# Altium schematic sheet LP_ECG_Pheripherals-X01.SchDoc: PHERIPHERALS
size Letter; Author: C. DEMOLDER; CompanyName: GTBID; DrawnBy: C. DEMOLDER; Engineer: C. DEMOLDER; Organization: GEORGIA TECH; Address1: NORTH AVE NW; Address2: ATLANTA, GA, 30332; DocumentNumber: P001; Revision: X01; SheetNumber: 2; SheetTotal: 4
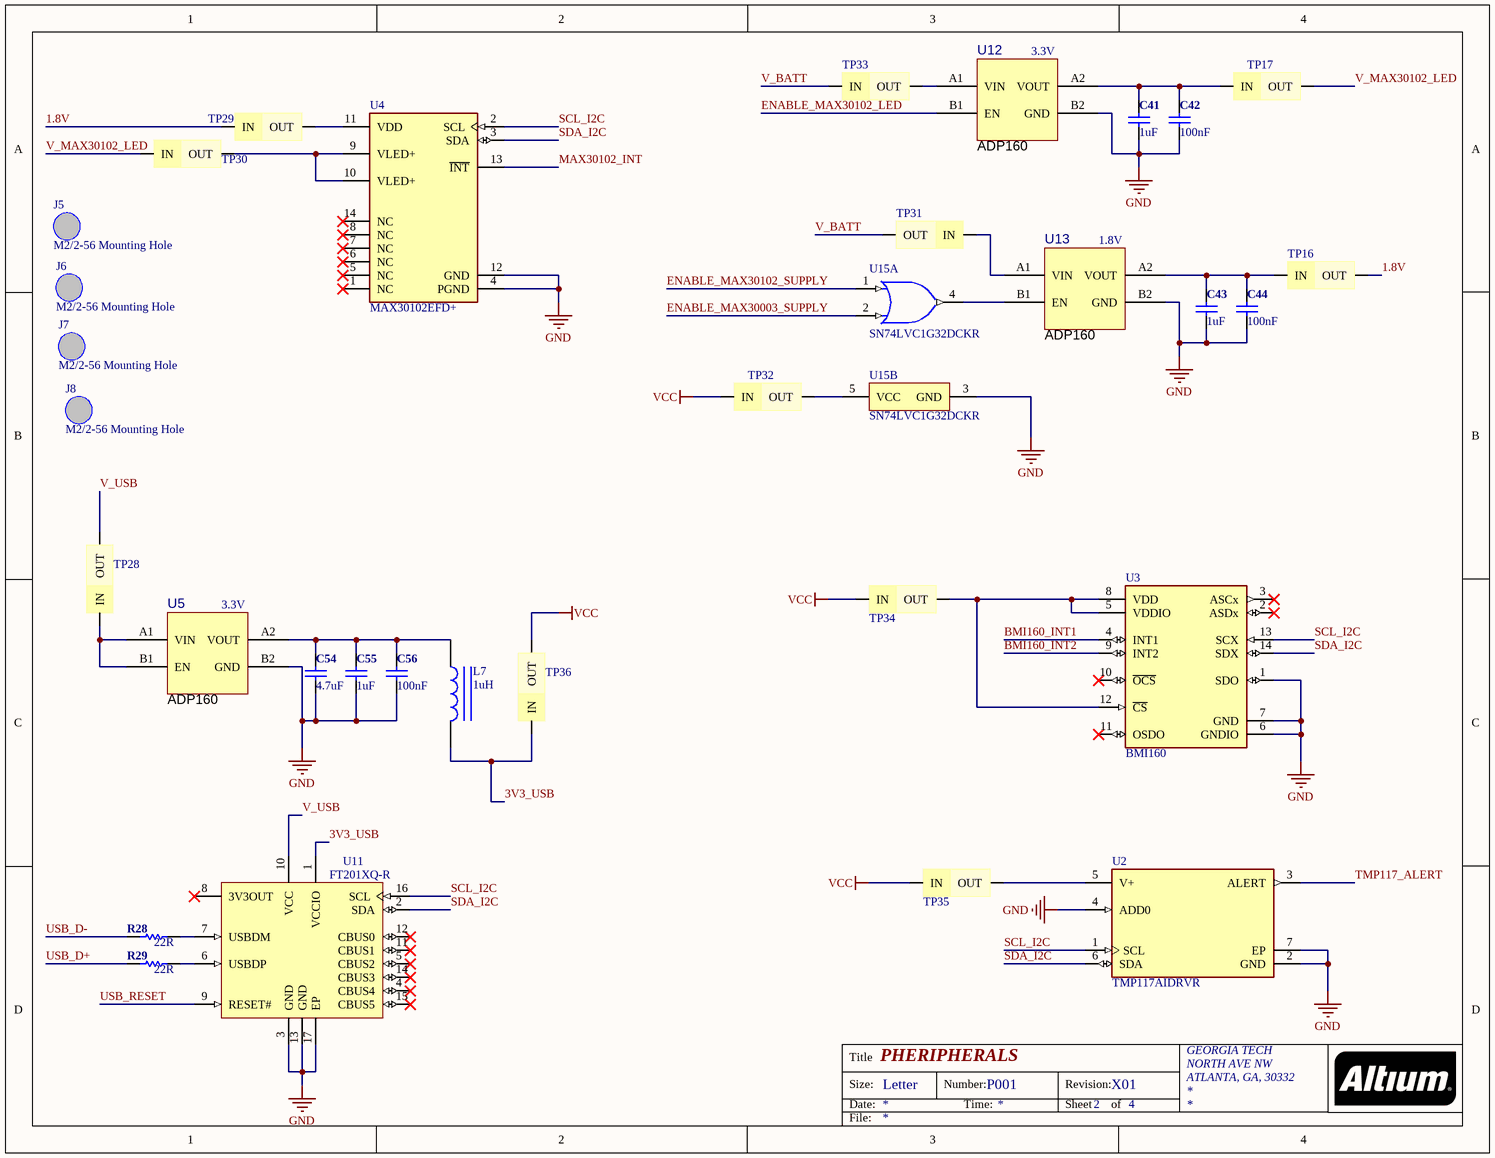
[diagram p0: LP_ECG_Pheripherals-X01.SchDoc]

## Parts
C41  1uF  [C0402]
C42  100nF  [C0402]
C43  1uF  [C0402]
C44  100nF  [C0402]
C54  4.7uF  [C0402]
C55  1uF  [C0402]
C56  100nF  [C0402]
J5  M2/2-56 Mounting Hole  [Mounting Hole]
J6  M2/2-56 Mounting Hole  [Mounting Hole]
J7  M2/2-56 Mounting Hole  [Mounting Hole]
J8  M2/2-56 Mounting Hole  [Mounting Hole]
L7  1uH  [L0402]
R28  22R  [R0402]
R29  22R  [R0402]
TP16  JUMPER  [JUMPER]  (value not drawn)
TP17  JUMPER  [JUMPER]  (value not drawn)
TP28  JUMPER  [JUMPER]  (value not drawn)
TP29  JUMPER  [JUMPER]  (value not drawn)
TP30  JUMPER  [JUMPER]  (value not drawn)
TP31  JUMPER  [JUMPER]  (value not drawn)
TP32  JUMPER  [JUMPER]  (value not drawn)
TP33  JUMPER  [JUMPER]  (value not drawn)
TP34  JUMPER  [JUMPER]  (value not drawn)
TP35  JUMPER  [JUMPER]  (value not drawn)
TP36  JUMPER  [JUMPER]  (value not drawn)
U2  TMP117AIDRVR  [TMP117AIDRVR]
U3  BMI160  [FP-BMI160-MFG]
U4  MAX30102EFD+  [FP-F143A5-1-MFG]
U5  ADP160  Output Voltage: 3.3V  [ADP160]
U11  FT201XQ-R  [QFN-16_N]
U12  ADP160  Output Voltage: 3.3V  [ADP160]
U13  ADP160  Output Voltage: 1.8V  [ADP160]
U15  SN74LVC1G32DCKR  [DCK0005A_N]  (parts A,B of 2)

## Nets
GND: C41.2 C42.1 C43.2 C44.1 C54.2 C55.2 C56.1 U2.2(GND) U2.4(ADD0) U2.7(EP) U3.1(SDO) U3.6(GNDIO) U3.7(GND) U4.4(PGND) U4.12(GND) U5.B2(GND) U11.3(GND) U11.13(GND) U11.17(EP) U12.B2(GND) U13.B2(GND) U15.3(GND)
VCC: TP32.1(IN) TP34.1(IN) TP35.1(IN) TP36.2(OUT)
1.8V: TP16.2(OUT) TP29.1(IN)
3V3_USB: L7.2 TP36.1(IN) U11.1(VCCIO)
BMI160_INT1: U3.4(INT1)
BMI160_INT2: U3.9(INT2)
ENABLE_MAX30003_SUPPLY: U15.2(B)
ENABLE_MAX30102_LED: U12.B1(EN)
ENABLE_MAX30102_SUPPLY: U15.1(A)
MAX30102_INT: U4.13(~{INT})
SCL_I2C: U2.1(SCL) U3.13(SCX) U4.2(SCL) U11.16(SCL)
SDA_I2C: U2.6(SDA) U3.14(SDX) U4.3(SDA) U11.2(SDA)
TMP117_ALERT: U2.3(ALERT)
USB_D+: R29.1
USB_D-: R28.1
USB_RESET: U11.9(RESET#)
V_BATT: TP31.2(OUT) TP33.1(IN)
V_MAX30102_LED: TP17.2(OUT) TP30.1(IN)
V_USB: TP28.2(OUT) U11.10(VCC)
NetC41_1: C41.1 C42.2 TP17.1(IN) U12.A2(VOUT)
NetC43_1: C43.1 C44.2 TP16.1(IN) U13.A2(VOUT)
NetC54_1: C54.1 C55.1 C56.2 L7.1 U5.A2(VOUT)
NetR28_2: R28.2 U11.7(USBDM)
NetR29_2: R29.2 U11.6(USBDP)
NetTP28_1: TP28.1(IN) U5.A1(VIN) U5.B1(EN)
NetTP29_2: TP29.2(OUT) U4.11(VDD)
NetTP30_2: TP30.2(OUT) U4.9(VLED+) U4.10(VLED+)
NetTP31_1: TP31.1(IN) U13.A1(VIN)
NetTP32_2: TP32.2(OUT) U15.5(VCC)
NetTP33_2: TP33.2(OUT) U12.A1(VIN)
NetTP34_2: TP34.2(OUT) U3.5(VDDIO) U3.8(VDD) U3.12(~{CS})
NetTP35_2: TP35.2(OUT) U2.5(V+)
NetU13_B1: U13.B1(EN) U15.4(Y)

Not connected (* = marked no-connect by the designer): U3 2(ASDx)* 3(ASCx)* 10(~{OCS})* 11(OSDO)*; U4 1(NC)* 5(NC)* 6(NC)* 7(NC)* 8(NC)* 14(NC)*; U11 4(CBUS4)* 5(CBUS2)* 8(3V3OUT)* 11(CBUS1)* 12(CBUS0)* 14(CBUS3)* 15(CBUS5)*

## Notes on the sheet
- Title
- Size:
- Date:
- Letter
- Number:
- Time:
- Revision:
- Sheet
- of
- File:

## Library data of the parts
C41 C43 C55 = C-0402(1005): Ceramic Capacitor, Multilayer, Ceramic, 6.3V, 20% +Tol, 20% -Tol, X5R, 15% TC, 1uF, Surface Mount, 0402; Manufacturer: Yageo; Manufacturer Part Number: CC0402MRX5R5BB105; Dissipation Factor: 10%; ComponentLink1URL: https://datasheet.ciiva.com/169/product-169683.pdf; ComponentLink1Description: https://datasheet.ciiva.com/169/product-169683.pdf; Supplier 1: Digi-Key; Supplier Part Number 1: 311-1441-1-ND; RoHS: Yes; Category: Ceramic Capacitors; Stock 1: 16697; Pricing 1: 1=0.13000, 10=0.08900, 100=0.04200, 500=0.02946, 1000=0.02439, 2500=0.02270, 5000=0.02076 (USD); Mount: Surface Mount; Case/Package: 0402; Number of Pins: 2; Case Code (Imperial): 0402; Case Code (Metric): 1005; Min Operating Temperature: -55°C; Max Operating Temperature: 85°C; Capacitance: 1uF; Tolerance: 20%; Voltage Rating: 6.3V; Voltage Rating (DC): 6.3V; Packaging: Tape and Reel; Package Quantity: 1; Dielectric: X5R; Termination: SMD/SMT; Composition: Ceramic; Length: 1mm; Height: 0.5mm; Width: 0.5mm; Thickness: 0.022inch; Depth: 0.5mm; Lead Free: Lead Free; Halogen Free: Halogen Free; ComponentLink2URL: https://datasheet.ciiva.com:443/pdfs/VipMasterIC/IC/YAGO/YAGO-S-A0006851646/YAGO-S-A0006851646-1.pdf?src-supplier=IHS+Markit; ComponentLink2Description: https://datasheet.ciiva.com:443/pdfs/VipMasterIC/IC/YAGO/YAGO-S-A0006851646/YAGO-S-A0006851646-1.pdf?src-supplier=IHS+Markit; ComponentLink3URL: https://datasheet.ciiva.com/176/mlccorderingcode-176806.pdf?src-supplier=Digi-Key; ComponentLink3Description: https://datasheet.ciiva.com/176/mlccorderingcode-176806.pdf?src-supplier=Digi-Key; ComponentLink4URL: https://datasheet.ciiva.com/176/mlccorderingcode-176807.pdf?src-supplier=Digi-Key; ComponentLink4Description: https://datasheet.ciiva.com/176/mlccorderingcode-176807.pdf?src-supplier=Digi-Key; ComponentLink5URL: https://datasheet.ciiva.com/176/mlccorderingcode-176808.pdf?src-supplier=Digi-Key; ComponentLink5Description: https://datasheet.ciiva.com/176/mlccorderingcode-176808.pdf?src-supplier=Digi-Key
C42 C44 C56 = C-0402(1005): Ceramic Capacitor, Multilayer, Ceramic, 25V, 10% +Tol, 10% -Tol, X5R, 15% TC, 0.1uF, Surface Mount, 0402; Manufacturer: Taiyo Yuden; Manufacturer Part Number: TMK105BJ104KV-F; ComponentLink1URL: https://datasheet.ciiva.com/169/product-169683.pdf; ComponentLink1Description: https://datasheet.ciiva.com/169/product-169683.pdf; Supplier 1: Digi-Key; Supplier Part Number 1: 587-1456-1-ND; RoHS: Yes; Category: Ceramic Capacitors; Stock 1: 27456801; Pricing 1: 1=0.10000, 10=0.04600, 100=0.02050, 500=0.01464, 1000=0.01150, 2500=0.01045, 5000=0.00961 (USD); Mount: Surface Mount; Case/Package: 0402; Number of Pins: 2; Weight: 2.3E-05oz; Case Code (Imperial): 0402; Case Code (Metric): 1005; Min Operating Temperature: -55°C; Max Operating Temperature: 85°C; Capacitance: 100nF; Tolerance: 10%; Packaging: Tape and Reel; Dielectric: X5R; Voltage Rating (DC): 25V; Voltage Rating: 25V; Package Quantity: 1; Termination: SMD/SMT; Composition: Ceramic; Voltage: 25V; Length: 1mm; Height: 0.5mm; Width: 0.5mm; Depth: 0.5mm; Thickness: 0.022inch; REACH SVHC: No SVHC; Lead Free: Lead Free; Halogen Free: Halogen Free; ComponentLink2URL: https://datasheet.ciiva.com:443/pdfs/VipMasterIC/IC/TAIY/TAIY-S-A0009103435/TAIY-S-A0009103038-1.pdf?src-supplier=IHS+Markit; ComponentLink2Description: https://datasheet.ciiva.com:443/pdfs/VipMasterIC/IC/TAIY/TAIY-S-A0009103435/TAIY-S-A0009103038-1.pdf?src-supplier=IHS+Markit; ComponentLink3URL: https://datasheet.ciiva.com/30051/25tmk105bj104kv-f-30051094.pdf?src-supplier=Onlinecomponents.com; ComponentLink3Description: https://datasheet.ciiva.com/30051/25tmk105bj104kv-f-30051094.pdf?src-supplier=Onlinecomponents.com; ComponentLink4URL: https://datasheet.ciiva.com/15922/28tmk105bj104kv-f-15922315.pdf?src-supplier=Onlinecomponents.com; ComponentLink4Description: https://datasheet.ciiva.com/15922/28tmk105bj104kv-f-15922315.pdf?src-supplier=Onlinecomponents.com; ComponentLink5URL: https://datasheet.ciiva.com/131/tmk105bj104kv-f-ss-131420.pdf?src-supplier=Digi-Key; ComponentLink5Description: https://datasheet.ciiva.com/131/tmk105bj104kv-f-ss-131420.pdf?src-supplier=Digi-Key; ComponentLink6URL: https://datasheet.ciiva.com/22768/1693457-22768649.pdf?src-supplier=Farnell; ComponentLink6Description: https://datasheet.ciiva.com/22768/1693457-22768649.pdf?src-supplier=Farnell
C54 = C-0402(1005): 0402 10 V 4.7 uF ±20% Tolerance X5R Multilayer Ceramic Chip Capacitor; Manufacturer: Murata; Manufacturer Part Number: GRM155R61A475MEAAD; Voltage Rating: 10V; ComponentLink1URL: https://datasheet.ciiva.com/169/product-169683.pdf; ComponentLink1Description: https://datasheet.ciiva.com/169/product-169683.pdf; Supplier 1: Digi-Key; Supplier Part Number 1: 490-14306-1-ND; Category: Ceramic Capacitors; Stock 1: 420733; Pricing 1: 1=0.25000, 10=0.16900, 100=0.08560, 500=0.05854, 1000=0.05179, 2500=0.04954, 5000=0.04503 (USD); Mount: Surface Mount; Case/Package: 0402; Case Code (Imperial): 0402; Case Code (Metric): 1005; Min Operating Temperature: -55°C; Max Operating Temperature: 85°C; Packaging: Tape and Reel; Capacitance: 4.7uF; Tolerance: 20%; ComponentLink2URL: https://psearch.en.murata.com:443/capacitor/product/GRM155R61A475MEAA%23.pdf?src-supplier=IHS+Markit; ComponentLink2Description: https://psearch.en.murata.com:443/capacitor/product/GRM155R61A475MEAA%23.pdf?src-supplier=IHS+Markit; ComponentLink3URL: http://www.farnell.com/datasheets/2189109.pdf?src-supplier=Farnell; ComponentLink3Description: http://www.farnell.com/datasheets/2189109.pdf?src-supplier=Farnell; ComponentLink4URL: https://search.murata.co.jp/Ceramy/image/img/A01X/G101/ENG/GRM155R61A475MEAA-01.pdf?src-supplier=Digi-Key; ComponentLink4Description: https://search.murata.co.jp/Ceramy/image/img/A01X/G101/ENG/GRM155R61A475MEAA-01.pdf?src-supplier=Digi-Key; ComponentLink5URL: http://www.farnell.com/datasheets/2189109.pdf?src-supplier=Element14; ComponentLink5Description: http://www.farnell.com/datasheets/2189109.pdf?src-supplier=Element14; ComponentLink6URL: http://www.farnell.com/datasheets/2189109.pdf?src-supplier=Newark; ComponentLink6Description: http://www.farnell.com/datasheets/2189109.pdf?src-supplier=Newark; ComponentLink7URL: http://datasheet.octopart.com/GRM155R61A475MEAAD-Murata-datasheet-138740730.pdf?src-supplier=Ciiva+Crawler; ComponentLink7Description: http://datasheet.octopart.com/GRM155R61A475MEAAD-Murata-datasheet-138740730.pdf?src-supplier=Ciiva+Crawler; ComponentLink8URL: http://datasheet.octopart.com/GRM155R61A475MEAAD-Murata-datasheet-140690084.pdf?src-supplier=Ciiva+Crawler; ComponentLink8Description: http://datasheet.octopart.com/GRM155R61A475MEAAD-Murata-datasheet-140690084.pdf?src-supplier=Ciiva+Crawler; ComponentLink9URL: http://datasheet.octopart.com/GRM155R61A475MEAAD-Murata-datasheet-68589269.pdf?src-supplier=Newark; ComponentLink9Description: http://datasheet.octopart.com/GRM155R61A475MEAAD-Murata-datasheet-68589269.pdf?src-supplier=Newark; ComponentLink10URL: http://datasheet.octopart.com/GRM155R61A475MEAAD-Murata-datasheet-8819587.pdf; ComponentLink10Description: http://datasheet.octopart.com/GRM155R61A475MEAAD-Murata-datasheet-8819587.pdf; ComponentLink11URL: http://datasheet.octopart.com/GRM155R61A475MEAAD-Murata-datasheet-10025737.pdf; ComponentLink11Description: http://datasheet.octopart.com/GRM155R61A475MEAAD-Murata-datasheet-10025737.pdf; ComponentLink12URL: http://datasheet.octopart.com/GRM155R61A475MEAAD-Murata-datasheet-11978611.pdf; ComponentLink12Description: http://datasheet.octopart.com/GRM155R61A475MEAAD-Murata-datasheet-11978611.pdf; ComponentLink13URL: http://datasheet.octopart.com/GRM155R61A475MEAAD-Murata-datasheet-12510076.pdf; ComponentLink13Description: http://datasheet.octopart.com/GRM155R61A475MEAAD-Murata-datasheet-12510076.pdf; ComponentLink14URL: http://datasheet.octopart.com/GRM155R61A475MEAAD-Murata-datasheet-12515295.pdf; ComponentLink14Description: http://datasheet.octopart.com/GRM155R61A475MEAAD-Murata-datasheet-12515295.pdf
L7 = Inductor Iron: General Purpose Inductor, 1uH, 20%, 1 Element, Ferrite-Core, SMD, 0402; Manufacturer: TDK; Manufacturer Part Number: MLZ1005M1R0WT000; Current Rating: 450mA; Saturation Current: 100mA; Shielding: Shielded; DC Resistance (DCR): 455mR; Self Resonant Frequency: 170MHz; Test Frequency: 2MHz; Supplier 1: Digi-Key; Supplier Part Number 1: 445-6379-1-ND; RoHS: Yes; Category: Fixed Inductors; Pricing 1: 1=0.29000, 10=0.25800, 100=0.17710, 500=0.15134, 1000=0.11592, 2500=0.10948 (USD); Mount: Surface Mount; Case/Package: 0402; Core Material: Ferrite; Case Code (Imperial): 0402; Case Code (Metric): 1005; Min Operating Temperature: -55°C; Max Operating Temperature: 125°C; Package Quantity: 10000; Packaging: Tape and Reel; Tolerance: 20%; Inductance: 1uH; Length: 0.039inch; Width: 0.02inch; Height - Seated (Max): 0.022inch; ComponentLink1URL: https://datasheet.ciiva.com:443/pdfs/VipMasterIC/IC/TDKC/TDKC-S-A0006811779/TDKC-S-A0006811779-1.pdf?src-supplier=IHS+Markit; ComponentLink1Description: https://datasheet.ciiva.com:443/pdfs/VipMasterIC/IC/TDKC/TDKC-S-A0006811779/TDKC-S-A0006811779-1.pdf?src-supplier=IHS+Markit; ComponentLink2URL: https://datasheet.ciiva.com/29699/inductor-commercial-decoupling-mlz-en-29699052.pdf?src-supplier=Digi-Key; ComponentLink2Description: https://datasheet.ciiva.com/29699/inductor-commercial-decoupling-mlz-en-29699052.pdf?src-supplier=Digi-Key; ComponentLink3URL: https://datasheet.ciiva.com/29699/inductor-commercial-decoupling-mlz-en-29699053.pdf?src-supplier=Digi-Key; ComponentLink3Description: https://datasheet.ciiva.com/29699/inductor-commercial-decoupling-mlz-en-29699053.pdf?src-supplier=Digi-Key
R28 R29 = R-0402(1005): Fixed Resistor, Metal Glaze/thick Film, 0.0625W, 22ohm, 50V, 5% +/-Tol, 100ppm/Cel, Surface Mount, 0402; Manufacturer: Yageo; Manufacturer Part Number: RC0402JR-0722RL; Temperature Coefficient: 100ppm/°C; Power Rating: 62.5mW; Max Power Dissipation: 63mW; Supplier 1: Digi-Key; Supplier Part Number 1: 311-22JRCT-ND; RoHS: Yes; Category: Chip SMD Resistors; Stock 1: 9648; Pricing 1: 1=0.10000, 10=0.01300, 100=0.00530, 1000=0.00236, 2500=0.00205, 5000=0.00169 (USD); Case/Package: 0402; Case Code (Metric): 1005; Case Code (Imperial): 0402; Min Operating Temperature: -55°C; Max Operating Temperature: 155°C; Tolerance: 5%; Resistance: 22R; Packaging: Tape and Reel; Composition: Thick Film; Voltage Rating: 50V; Number of Terminations: 2; Package Quantity: 1; Termination: SMD/SMT; Military Standard: Not; Features: Moisture Resistant; Length: 0.039inch; Height: 0.016inch; Width: 0.02inch; Depth: 0.5mm; Lead Free: Lead Free; REACH SVHC: No SVHC; ComponentLink1URL: https://datasheet.ciiva.com:443/pdfs/VipMasterIC/IC/YAGO/YAGO-S-A0008145938/YAGO-S-A0008145938-1.pdf?src-supplier=IHS+Markit; ComponentLink1Description: https://datasheet.ciiva.com:443/pdfs/VipMasterIC/IC/YAGO/YAGO-S-A0008145938/YAGO-S-A0008145938-1.pdf?src-supplier=IHS+Markit; ComponentLink2URL: https://datasheet.ciiva.com/2452/pyu-r-int-thick-7-2452770.pdf?src-supplier=Digi-Key; ComponentLink2Description: https://datasheet.ciiva.com/2452/pyu-r-int-thick-7-2452770.pdf?src-supplier=Digi-Key; ComponentLink3URL: https://datasheet.ciiva.com/7850/1018594-7850181.pdf?src-supplier=Element14; ComponentLink3Description: https://datasheet.ciiva.com/7850/1018594-7850181.pdf?src-supplier=Element14; ComponentLink4URL: https://datasheet.ciiva.com/46394/1018594-46394972.pdf?src-supplier=Element14; ComponentLink4Description: https://datasheet.ciiva.com/46394/1018594-46394972.pdf?src-supplier=Element14; ComponentLink5URL: https://datasheet.ciiva.com/2452/pyu-r-int-thick-7-2452771.pdf?src-supplier=Digi-Key; ComponentLink5Description: https://datasheet.ciiva.com/2452/pyu-r-int-thick-7-2452771.pdf?src-supplier=Digi-Key; ComponentLink6URL: https://datasheet.ciiva.com/2452/pyu-r-int-thick-7-2452772.pdf?src-supplier=Digi-Key; ComponentLink6Description: https://datasheet.ciiva.com/2452/pyu-r-int-thick-7-2452772.pdf?src-supplier=Digi-Key; ComponentLink7URL: https://datasheet.ciiva.com/12656/pyu-rc0402-51-rohs-l-6-r-12656926.pdf?src-supplier=Mouser; ComponentLink7Description: https://datasheet.ciiva.com/12656/pyu-rc0402-51-rohs-l-6-r-12656926.pdf?src-supplier=Mouser
TP16 TP17 TP28-TP36 = JUMPER: SHUNT LP W/HANDLE 2 POS 30AU; Manufacturer: TE Connectivity; Manufacturer Part Number: 8815452; Number of Contacts: 2; Contact Current Rating: 3A; Contact Resistance: 15mR; Gender: Female; Pitch: 2.54mm; Approvals: UL,CSA; Supplier 1: Digi-Key; Supplier Part Number 1: A26242-ND; RoHS: Yes; Category: Headers and Wire Housings; Stock 1: 2099; Pricing 1: 1=0.280000, 10=0.262000, 25=0.223600, 50=0.195600, 100=0.181700, 250=0.160760, 500=0.153760, 1000=0.125800, 2500=0.115320 (USD); Contact Plating: Gold; Housing Color: Black; Housing Material: Thermoplastic; Contact Material: Bronze; Color: Black; Min Operating Temperature: -65°C; Max Operating Temperature: 105°C; Number of Rows: 1; Package Quantity: 14000; Packaging: Bag; Orientation: Straight; Number of Positions: 2; Contact Gender: Female; Current Rating: 3A; Termination: Solder; Length: 5.08mm; Height: 10.9mm; Depth: 10.9mm; Width: 2.5mm; Radiation Hardening: No; Flammability Rating: UL94 V-0; REACH SVHC: No SVHC; ComponentLink1URL: https://datasheet.ciiva.com/1455/92946-1455888.pdf?src-supplier=Newark; ComponentLink1Description: https://datasheet.ciiva.com/1455/92946-1455888.pdf?src-supplier=Newark; ComponentLink2URL: https://datasheet.ciiva.com/19459/841467-19459897.pdf?src-supplier=Jameco; ComponentLink2Description: https://datasheet.ciiva.com/19459/841467-19459897.pdf?src-supplier=Jameco; ComponentLink3URL: https://datasheet.ciiva.com/15174/getdatasheetpartid-155768-15174939.pdf?src-supplier=Verical; ComponentLink3Description: https://datasheet.ciiva.com/15174/getdatasheetpartid-155768-15174939.pdf?src-supplier=Verical; ComponentLink4URL: https://datasheet.ciiva.com/11754/0900766b80da19e8-11754990.pdf?src-supplier=RSComponents; ComponentLink4Description: https://datasheet.ciiva.com/11754/0900766b80da19e8-11754990.pdf?src-supplier=RSComponents; ComponentLink5URL: https://datasheet.ciiva.com/30154/eng-cs-1307819-section-6-7and8-0808-30154293.pdf?src-supplier=Onlinecomponents.com; ComponentLink5Description: https://datasheet.ciiva.com/30154/eng-cs-1307819-section-6-7and8-0808-30154293.pdf?src-supplier=Onlinecomponents.com; ComponentLink6URL: https://datasheet.ciiva.com/767/eng-cd-881545-k3-767850.pdf?src-supplier=Digi-Key; ComponentLink6Description: https://datasheet.ciiva.com/767/eng-cd-881545-k3-767850.pdf?src-supplier=Digi-Key; ComponentLink7URL: https://datasheet.ciiva.com/3120/eng-cs-1307819-section-6-7and8-0808-3120202.pdf?src-supplier=Avnet; ComponentLink7Description: https://datasheet.ciiva.com/3120/eng-cs-1307819-section-6-7and8-0808-3120202.pdf?src-supplier=Avnet
U2 = bceab6869a9cb85cf5675529ee35ce4: TEMPERATURE SENSOR; Manufacturer: Texas Instruments; Operating Supply Current: 3.5-16uA; Standoff Height: 0mm; Min Supply Voltage: 1.8V; Resolution: 16bits; Interface: I2C,2-Wire,SMBus; Max Junction Temp: +150°C; Max Supply Voltage: 5.5V; Output Type: I2C; Octopart: https://octopart.com/tmp117aidrvr-texas+instruments-95511044; Lead Free: Yes; ComponentLink2Description: Datasheet; Temperature Range High: +150°C; Manufacturer Part Number: TMP117AIDRVR; Ambient Temperature Range High: +150°C; Ambient Temperature Range Low: -55°C; Height: 0.8mm; ComponentLink2URL: http://www.ti.com/lit/ds/symlink/tmp117.pdf; Automotive: No; Device Class L1: Sensors; RoHS: TRUE; Package: DRV0006A; Device Class L3: unset; Temperature: -55°C to +150°C; Temperature Range Low: -55°C; Ipc Land Pattern Name: DFN200X200X80-6; Device Class L2: Temperature and Humidity Sensors; Category: IC; Digikey Description: TEMPERATURE SENSOR; Supplier 1: Digi-Key; Supplier Part Number 1: 296-51834-1-ND; Stock 1: 3558; Pricing 1: 1=8.02000, 5=7.07600, 10=6.25000, 25=5.07040, 50=4.48100, 100=4.36300, 500=3.65552, 1000=3.41968 (USD); Mount: Surface Mount; Min Operating Temperature: -55°C; Max Operating Temperature: 150°C; Packaging: Cut Tape; ComponentLink1URL: https://www.ti.com:443/lit/ds/symlink/tmp117.pdf?src-supplier=IHS+Markit; ComponentLink1Description: https://www.ti.com:443/lit/ds/symlink/tmp117.pdf?src-supplier=IHS+Markit; ComponentLink3URL: http://www.ti.com/lit/gpn/tmp117?src-supplier=Digi-Key; ComponentLink3Description: http://www.ti.com/lit/gpn/tmp117?src-supplier=Digi-Key
U3 = CMP-191067-000003-1: IMU ACCEL/GYRO I2C/SPI 14LGA; Manufacturer: Bosch; Sensor Type: Accelerometer,Gyroscope,3 Axis; Output Type: SPI,I2C; Supplier 1: Digi-Key; Supplier Part Number 1: 828-1057-1-ND; Manufacturer Part Number: BMI160; RoHS: No; Category: Inertial Measurement Units (IMUs); Stock 1: 36621; Pricing 1: 1=4.98000, 5=4.39600, 10=3.88300, 25=3.15000, 50=2.78380, 100=2.71060, 500=2.27106, 1000=2.21760 (USD); Mount: Surface Mount; Case/Package: LGA; Min Operating Temperature: -40°C; Max Operating Temperature: 85°C; Packaging: Cut Tape; Lead Free: Lead Free; ComponentLink1URL: https://ae-bst.resource.bosch.com/media/_tech/media/datasheets/BST-BMI160-DS000.pdf?src-supplier=Digi-Key; ComponentLink1Description: https://ae-bst.resource.bosch.com/media/_tech/media/datasheets/BST-BMI160-DS000.pdf?src-supplier=Digi-Key; ComponentLink2URL: https://ae-bst.resource.bosch.com/media/_tech/media/application_notes/BST-MIS-HS001.pdf?src-supplier=Digi-Key; ComponentLink2Description: https://ae-bst.resource.bosch.com/media/_tech/media/application_notes/BST-MIS-HS001.pdf?src-supplier=Digi-Key
U4 = CMP-05738-000003-1: IC SENSOR OXIMETER/HEARTRATE; Manufacturer: Maxim; Min Supply Voltage: 1.7V; Max Supply Voltage: 2V; Supplier 1: Digi-Key; Supplier Part Number 1: MAX30102EFD+-ND; Manufacturer Part Number: MAX30102EFD+; RoHS: Yes; Category: Decoders and Multiplexers; Stock 1: 140; Pricing 1: 1=9.51000, 10=8.59500, 25=8.19480, 100=7.11560, 500=6.19612, 1000=5.39663, 5000=4.99688 (USD); Number of Pins: 14; Min Operating Temperature: -40°C; Max Operating Temperature: 85°C; REACH SVHC: No SVHC; ComponentLink1URL: http://www.farnell.com/datasheets/2162814.pdf?src-supplier=Farnell; ComponentLink1Description: http://www.farnell.com/datasheets/2162814.pdf?src-supplier=Farnell; ComponentLink2URL: https://datasheets.maximintegrated.com/en/ds/MAX30102.pdf?src-supplier=Digi-Key; ComponentLink2Description: https://datasheets.maximintegrated.com/en/ds/MAX30102.pdf?src-supplier=Digi-Key; ComponentLink3URL: http://www.farnell.com/datasheets/2162814.pdf?src-supplier=Element14; ComponentLink3Description: http://www.farnell.com/datasheets/2162814.pdf?src-supplier=Element14
U5 U12 = ADP160-3_3V: Fixed Positive LDO Regulator, 3.3V, 0.195V Dropout, CMOS, PBGA4; Manufacturer: Analog Devices; Manufacturer Part Number: ADP160ACBZ-3.3-R7; Min Input Voltage: 2.2V; Max Input Voltage: 5.5V; Max Output Current: 150mA; Nominal Supply Current: 42uA; Number of Outputs: 1; Min Output Voltage: 1.2V; Max Output Voltage: 4.2V; Power Supply Rejection Ratio (PSRR): 60dB; Accuracy: 2%; Dropout Voltage: 105mV; Min Current Limit: 220mA; Supplier 1: Digi-Key; Supplier Part Number 1: ADP160ACBZ-3.3-R7CT-ND; RoHS: Yes; Category: Voltage Regulators - Linear; Pricing 1: 1=1.12000, 10=1.00300, 25=0.95200, 100=0.73100, 250=0.64600, 500=0.61200, 1000=0.49300 (USD); Mount: Surface Mount; Number of Pins: 4; Min Operating Temperature: -40°C; Max Operating Temperature: 125°C; Packaging: Tape and Reel; Operating Supply Current: 42uA; Package Quantity: 3000; Output Current: 150mA; Output Type: Fixed; Max Supply Current: 42uA; Polarity: Positive; Number of Regulators: 1; Nominal Output Voltage: 3.3V; Output Voltage Accuracy: 2%; Radiation Hardening: No; REACH SVHC: No SVHC; Lead Free: Contains Lead; ComponentLink1URL: https://datasheet.ciiva.com:443/pdfs/VipMasterIC/IC/ANDI/ANDI-S-A0005865400/ANDI-S-A0005865400-1.pdf?src-supplier=IHS+Markit; ComponentLink1Description: https://datasheet.ciiva.com:443/pdfs/VipMasterIC/IC/ANDI/ANDI-S-A0005865400/ANDI-S-A0005865400-1.pdf?src-supplier=IHS+Markit; ComponentLink2URL: https://datasheet.ciiva.com/15271/adp160-161-162-163-15271721.pdf?src-supplier=Arrow+Europe; ComponentLink2Description: https://datasheet.ciiva.com/15271/adp160-161-162-163-15271721.pdf?src-supplier=Arrow+Europe; ComponentLink3URL: https://datasheet.ciiva.com/8242/adp160-161-162-163-8242024.pdf?src-supplier=Avnet; ComponentLink3Description: https://datasheet.ciiva.com/8242/adp160-161-162-163-8242024.pdf?src-supplier=Avnet; ComponentLink4URL: https://datasheet.ciiva.com/18552/adp160-161-162-163-18552347.pdf?src-supplier=Digi-Key; ComponentLink4Description: https://datasheet.ciiva.com/18552/adp160-161-162-163-18552347.pdf?src-supplier=Digi-Key; ComponentLink5URL: https://datasheet.ciiva.com/18552/adp160-161-162-163-18552348.pdf?src-supplier=Digi-Key; ComponentLink5Description: https://datasheet.ciiva.com/18552/adp160-161-162-163-18552348.pdf?src-supplier=Digi-Key; ComponentLink6URL: https://datasheet.ciiva.com/18552/adp160-161-162-163-18552349.pdf?src-supplier=Digi-Key; ComponentLink6Description: https://datasheet.ciiva.com/18552/adp160-161-162-163-18552349.pdf?src-supplier=Digi-Key
U11 = COM-USB-FT201XQ-SQ17: USB to I2C Interface Slave Chip, UHCI/OHCI/EHCI Compatible, USB 2.0 Compatible, -40 to +85 degC, 16-Pin QFN, Pb-Free, Tape and Reel; Manufacturer: FTDI; Operating Supply Voltage: 5.5V; Data Rate: 12Mbps; Interface: I2C,USB; Operating Supply Current: 8mA; ComponentLink2URL: http://www.ftdichip.com/Support/Documents/DataSheets/ICs/DS_FT201X.pdf; DatasheetVersion: ver 1.3, Feb-2013; RevisionNote: DatasheetVersion updated to 1.3 Feb-2013; ComponentLink1URL: http://www.ftdichip.com/; PackageReference: QFN-16; PackageVersion: Feb-13; ComponentLink3URL: www.ftdichip.com/Products/ICs/FT201X.html; ComponentLink2Description: Datasheet; PackageDescription: 16-Pin Quad Flat No-Lead, 4x4 mm Body, 0.65 mm Pitch; ComponentLink1Description: Manufacturer URL; PartNumber: FT201XQ-R; Code_JEDEC: MO-220WGGC; ComponentLink3Description: FT201X Product Page; Supplier 1: Digi-Key; Supplier Part Number 1: 768-1131-1-ND; Manufacturer Part Number: FT201XQ-R; RoHS: Yes; Category: Interface ICs; Stock 1: 4553; Pricing 1: 1=2.04000, 25=1.97000, 100=1.90000, 250=1.71000, 500=1.54002, 1000=1.46001, 2500=1.43750 (USD); Mount: Surface Mount; Case/Package: QFN; Number of Pins: 16; Weight: 0.002014oz; Min Operating Temperature: -40°C; Max Operating Temperature: 85°C; Packaging: Tape and Reel; Package Quantity: 5000; Length: 4mm; Height: 0.75mm; Width: 4mm; Lead Free: Lead Free; ComponentLink4URL: https://datasheet.ciiva.com:443/pdfs/VipMasterIC/IC/FTDI/FTDI-S-A0003060850/FTDI-S-A0003060850-1.pdf?src-supplier=IHS+Markit; ComponentLink4Description: https://datasheet.ciiva.com:443/pdfs/VipMasterIC/IC/FTDI/FTDI-S-A0003060850/FTDI-S-A0003060850-1.pdf?src-supplier=IHS+Markit; ComponentLink5URL: https://datasheet.ciiva.com/14668/0900766b811020ab-14668386.pdf?src-supplier=RSComponents; ComponentLink5Description: https://datasheet.ciiva.com/14668/0900766b811020ab-14668386.pdf?src-supplier=RSComponents; ComponentLink6URL: https://datasheet.ciiva.com/1784/ft-x-series-1784572.pdf?src-supplier=Digi-Key; ComponentLink6Description: https://datasheet.ciiva.com/1784/ft-x-series-1784572.pdf?src-supplier=Digi-Key; ComponentLink7URL: https://datasheet.ciiva.com/1784/ft-x-series-1784573.pdf?src-supplier=Digi-Key; ComponentLink7Description: https://datasheet.ciiva.com/1784/ft-x-series-1784573.pdf?src-supplier=Digi-Key; ComponentLink8URL: https://datasheet.ciiva.com/1784/ft-x-series-1784574.pdf?src-supplier=Digi-Key; ComponentLink8Description: https://datasheet.ciiva.com/1784/ft-x-series-1784574.pdf?src-supplier=Digi-Key
U13 = ADP160-1_8V: Fixed Positive LDO Regulator, 1.8V, 0.195V Dropout, CMOS, PBGA4; Manufacturer: Analog Devices; Manufacturer Part Number: ADP160ACBZ-1.8-R7; Max Output Current: 150mA; Min Input Voltage: 2.2V; Max Input Voltage: 5.5V; Number of Outputs: 1; Operating Supply Current: 42uA; Min Output Voltage: 1.2V; Max Output Voltage: 4.2V; Accuracy: 2%; Power Supply Rejection Ratio (PSRR): 60dB; Min Current Limit: 220mA; Quiescent Current: 0pA; Supplier 1: Digi-Key; Supplier Part Number 1: ADP160ACBZ-1.8-R7CT-ND; RoHS: Yes; Category: Voltage Regulators - Linear; Stock 1: 5770; Pricing 1: 1=1.12000, 10=1.00300, 25=0.95200, 100=0.73100, 250=0.64600, 500=0.61200, 1000=0.49300 (USD); Mount: Surface Mount; Number of Pins: 4; Contact Plating: Copper,Tin,Silver; Min Operating Temperature: -40°C; Max Operating Temperature: 125°C; Packaging: Tape and Reel; Output Current: 150mA; Nominal Supply Current: 42uA; Output Type: Fixed; Polarity: Positive; Max Supply Current: 42uA; Number of Regulators: 1; Package Quantity: 1; Output Voltage Accuracy: 2%; Length: 1mm; Height: 0.37mm; Width: 1mm; Radiation Hardening: No; Lead Free: Contains Lead; ComponentLink1URL: https://datasheet.ciiva.com:443/pdfs/VipMasterIC/IC/ANDI/ANDI-S-A0005865400/ANDI-S-A0005865400-1.pdf?src-supplier=IHS+Markit; ComponentLink1Description: https://datasheet.ciiva.com:443/pdfs/VipMasterIC/IC/ANDI/ANDI-S-A0005865400/ANDI-S-A0005865400-1.pdf?src-supplier=IHS+Markit; ComponentLink2URL: https://datasheet.ciiva.com/15270/adp160-161-162-163-15270706.pdf?src-supplier=Arrow+Europe; ComponentLink2Description: https://datasheet.ciiva.com/15270/adp160-161-162-163-15270706.pdf?src-supplier=Arrow+Europe; ComponentLink3URL: https://datasheet.ciiva.com/18552/adp160-161-162-163-18552055.pdf?src-supplier=Digi-Key; ComponentLink3Description: https://datasheet.ciiva.com/18552/adp160-161-162-163-18552055.pdf?src-supplier=Digi-Key; ComponentLink4URL: https://datasheet.ciiva.com/18552/adp160-161-162-163-18552056.pdf?src-supplier=Digi-Key; ComponentLink4Description: https://datasheet.ciiva.com/18552/adp160-161-162-163-18552056.pdf?src-supplier=Digi-Key; ComponentLink5URL: https://datasheet.ciiva.com/18552/adp160-161-162-163-18552054.pdf?src-supplier=Digi-Key; ComponentLink5Description: https://datasheet.ciiva.com/18552/adp160-161-162-163-18552054.pdf?src-supplier=Digi-Key; ComponentLink6URL: https://datasheet.ciiva.com/3224/adp160-161-162-163-3224663.pdf?src-supplier=Avnet; ComponentLink6Description: https://datasheet.ciiva.com/3224/adp160-161-162-163-3224663.pdf?src-supplier=Avnet
U15 = CMP-0859-00376-3: Single 2-Input Positive-OR Gate, DCK0005A, LARGE T&R; Manufacturer: Texas Instruments; Number of Inputs: 2; Min Supply Voltage: 1.65V; Max Supply Voltage: 5.5V; Propagation Delay: 4ns; Logic Function: OR; Number of Circuits: 1; Quiescent Current: 10uA; High Level Output Current: -32mA; Low Level Output Current: 32mA; Turn-On Delay Time: 4.5ns; Schmitt Trigger Input: No; Supplier 1: Digi-Key; Supplier Part Number 1: 296-9848-1-ND; Manufacturer Part Number: SN74LVC1G32DCKR; RoHS: Yes; Category: Logic Gates; Stock 1: 92112; Pricing 1: 1=0.29000, 10=0.23700, 25=0.19800, 100=0.12540, 250=0.09680, 500=0.08250, 1000=0.05610 (USD); Mount: Surface Mount; Case/Package: SC; Number of Pins: 5; Weight: 8.8E-05oz; Contact Plating: Gold; Min Operating Temperature: -40°C; Max Operating Temperature: 125°C; Package Quantity: 1; Packaging: Tape and Reel; Number of Bits: 1; Number of Elements: 1; Number of Outputs: 1; Number of Gates: 1; Number of Input Lines: 2; Number of Output Lines: 1; Output Current: 32mA; Termination: SMD/SMT; Max Output Current: 32mA; Length: 2mm; Height: 0.9mm; Width: 1.25mm; Radiation Hardening: No; Lead Free: Lead Free; REACH SVHC: No SVHC; ComponentLink1URL: https://www.ti.com:443/lit/ds/symlink/sn74lvc1g32.pdf?src-supplier=IHS+Markit; ComponentLink1Description: https://www.ti.com:443/lit/ds/symlink/sn74lvc1g32.pdf?src-supplier=IHS+Markit; ComponentLink2URL: https://datasheet.ciiva.com/27049/756781-27049784.pdf?src-supplier=Jameco; ComponentLink2Description: https://datasheet.ciiva.com/27049/756781-27049784.pdf?src-supplier=Jameco; ComponentLink3URL: https://datasheet.ciiva.com/1864/sn74lvc1g32-1864192.pdf?src-supplier=Digi-Key; ComponentLink3Description: https://datasheet.ciiva.com/1864/sn74lvc1g32-1864192.pdf?src-supplier=Digi-Key; ComponentLink4URL: https://datasheet.ciiva.com/6124/1768050-6124560.pdf?src-supplier=Farnell; ComponentLink4Description: https://datasheet.ciiva.com/6124/1768050-6124560.pdf?src-supplier=Farnell; ComponentLink5URL: https://datasheet.ciiva.com/15090/getdatasheetpartid-127914-15090759.pdf?src-supplier=Verical; ComponentLink5Description: https://datasheet.ciiva.com/15090/getdatasheetpartid-127914-15090759.pdf?src-supplier=Verical; ComponentLink6URL: https://datasheet.ciiva.com/16503/sn74lvc1g32-16503418.pdf?src-supplier=Avnet+Asia; ComponentLink6Description: https://datasheet.ciiva.com/16503/sn74lvc1g32-16503418.pdf?src-supplier=Avnet+Asia; ComponentLink7URL: https://datasheet.ciiva.com/7783/1768050-7783469.pdf?src-supplier=Element14; ComponentLink7Description: https://datasheet.ciiva.com/7783/1768050-7783469.pdf?src-supplier=Element14; ComponentLink8URL: https://datasheet.ciiva.com/7783/1768050-7783470.pdf?src-supplier=Element14; ComponentLink8Description: https://datasheet.ciiva.com/7783/1768050-7783470.pdf?src-supplier=Element14; ComponentLink9URL: https://datasheet.ciiva.com/26048/sn74lvc1g32-26048814.pdf?src-supplier=Avnet+Europe; ComponentLink9Description: https://datasheet.ciiva.com/26048/sn74lvc1g32-26048814.pdf?src-supplier=Avnet+Europe; ComponentLink10URL: https://datasheet.ciiva.com/1864/sn74lvc1g32-1864193.pdf?src-supplier=Digi-Key; ComponentLink10Description: https://datasheet.ciiva.com/1864/sn74lvc1g32-1864193.pdf?src-supplier=Digi-Key; ComponentLink11URL: https://datasheet.ciiva.com/14290/sn74lvc1g32-14290781.pdf?src-supplier=Avnet; ComponentLink11Description: https://datasheet.ciiva.com/14290/sn74lvc1g32-14290781.pdf?src-supplier=Avnet; ComponentLink12URL: https://datasheet.ciiva.com/1864/sn74lvc1g32-1864191.pdf?src-supplier=Digi-Key; ComponentLink12Description: https://datasheet.ciiva.com/1864/sn74lvc1g32-1864191.pdf?src-supplier=Digi-Key